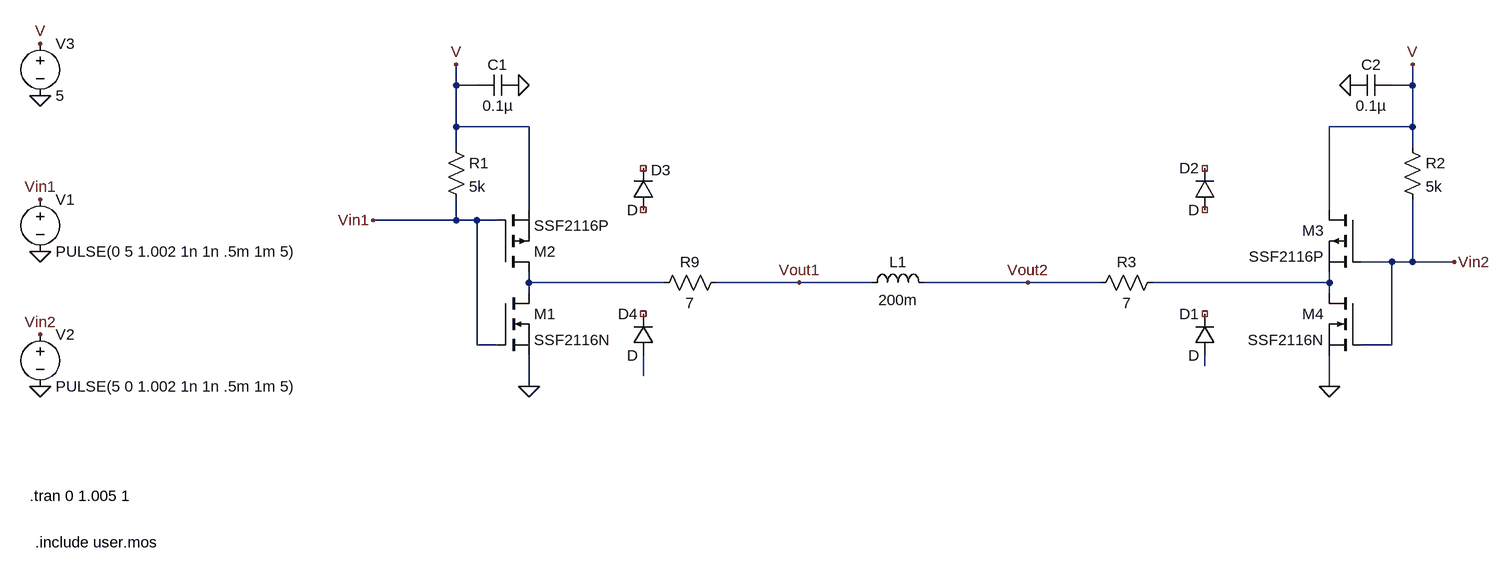
[diagram p0: schematic H-bridge.asc]
H-bridge.asc, the LTspice schematic file:
Version 4
SHEET 1 1344 852
WIRE -544 -256 -544 -288
WIRE -512 -256 -544 -256
WIRE 928 -256 928 -288
WIRE 928 -256 896 -256
WIRE -544 -192 -544 -256
WIRE -432 -192 -544 -192
WIRE 928 -192 928 -256
WIRE 928 -192 800 -192
WIRE -544 -160 -544 -192
WIRE 928 -160 928 -192
WIRE -432 -64 -432 -192
WIRE 800 -64 800 -192
WIRE -544 -48 -544 -80
WIRE -544 -48 -672 -48
WIRE -512 -48 -544 -48
WIRE -480 -48 -512 -48
WIRE 896 16 848 16
WIRE 928 16 928 -80
WIRE 928 16 896 16
WIRE 992 16 928 16
WIRE -432 48 -432 32
WIRE -224 48 -432 48
WIRE -16 48 -144 48
WIRE 96 48 -16 48
WIRE 336 48 176 48
WIRE 448 48 336 48
WIRE 800 48 800 32
WIRE 800 48 528 48
WIRE -432 64 -432 48
WIRE 800 64 800 48
WIRE -512 144 -512 -48
WIRE -480 144 -512 144
WIRE 896 144 896 16
WIRE 896 144 848 144
WIRE 608 176 608 160
WIRE -256 192 -256 160
WIRE -432 208 -432 160
WIRE 800 208 800 160
FLAG -432 208 0
FLAG -448 -256 0
FLAG -672 -48 Vin1
FLAG 800 208 0
FLAG 832 -256 0
FLAG -16 48 Vout1
FLAG 336 48 Vout2
FLAG 992 16 Vin2
FLAG -1184 -240 0
FLAG -1184 -320 V
FLAG -544 -288 V
FLAG 928 -288 V
FLAG -1184 208 0
FLAG -1184 0 0
FLAG -1184 -80 Vin1
FLAG -1184 128 Vin2
SYMBOL nmos -480 64 R0
SYMATTR InstName M1
SYMATTR Value SSF2116N
SYMBOL pmos -480 32 M180
SYMATTR InstName M2
SYMATTR Value SSF2116P
SYMBOL res -128 32 R90
WINDOW 0 0 56 VBottom 2
WINDOW 3 32 56 VTop 2
SYMATTR InstName R9
SYMATTR Value 7
SYMBOL voltage -1184 -96 R0
WINDOW 123 0 0 Left 0
WINDOW 39 0 0 Left 0
SYMATTR InstName V1
SYMATTR Value PULSE(0 5 1.002 1n 1n .5m 1m 5)
SYMBOL res -560 -176 R0
SYMATTR InstName R1
SYMATTR Value 5k
SYMBOL cap -448 -272 R90
WINDOW 0 0 32 VBottom 2
WINDOW 3 32 32 VTop 2
SYMATTR InstName C1
SYMATTR Value 0.1µ
SYMBOL ind 80 64 R270
WINDOW 0 32 56 VTop 2
WINDOW 3 5 56 VBottom 2
SYMATTR InstName L1
SYMATTR Value 200m
SYMBOL pmos 848 -64 M0
SYMATTR InstName M3
SYMATTR Value SSF2116P
SYMBOL nmos 848 64 M0
SYMATTR InstName M4
SYMATTR Value SSF2116N
SYMBOL res 912 -176 R0
SYMATTR InstName R2
SYMATTR Value 5k
SYMBOL cap 896 -272 R90
WINDOW 0 0 32 VBottom 2
WINDOW 3 32 32 VTop 2
SYMATTR InstName C2
SYMATTR Value 0.1µ
SYMBOL voltage -1184 112 R0
WINDOW 123 0 0 Left 0
WINDOW 39 0 0 Left 0
SYMATTR InstName V2
SYMATTR Value PULSE(5 0 1.002 1n 1n .5m 1m 5)
SYMBOL voltage -1184 -336 R0
WINDOW 123 0 0 Left 0
WINDOW 39 0 0 Left 0
SYMATTR InstName V3
SYMATTR Value 5
SYMBOL res 544 32 R90
WINDOW 0 0 56 VBottom 2
WINDOW 3 32 56 VTop 2
SYMATTR InstName R3
SYMATTR Value 7
SYMBOL diode 624 160 R180
WINDOW 0 24 64 Left 2
WINDOW 3 24 0 Left 2
SYMATTR InstName D1
SYMBOL diode 624 -64 R180
WINDOW 0 24 64 Left 2
WINDOW 3 24 0 Left 2
SYMATTR InstName D2
SYMBOL diode -240 -64 R180
WINDOW 0 -27 61 Left 2
WINDOW 3 24 0 Left 2
SYMATTR InstName D3
SYMBOL diode -240 160 R180
WINDOW 0 24 64 Left 2
WINDOW 3 24 0 Left 2
SYMATTR InstName D4
TEXT -1200 376 Left 2 !.tran 0 1.005 1
TEXT -1192 448 Left 2 !.include user.mos

The netlist it stands for:
* H-bridge.asc
M1 N001 Vin1 0 0 SSF2116N
M2 N001 Vin1 V V SSF2116P
R9 Vout1 N001 7
V1 Vin1 0 PULSE(0 5 1.002 1n 1n .5m 1m 5)
R1 V Vin1 5k
C1 0 V 0.1µ
L1 Vout1 Vout2 200m
M3 V Vin2 N002 N002 SSF2116P
M4 N002 Vin2 0 0 SSF2116N
R2 V Vin2 5k
C2 V 0 0.1µ
V2 Vin2 0 PULSE(5 0 1.002 1n 1n .5m 1m 5)
V3 V 0 5
R3 N002 Vout2 7
D1 N003 NC_01 D
D2 NC_02 NC_03 D
D3 NC_04 NC_05 D
D4 N004 NC_06 D
.model D D
.lib standard.dio
.model NMOS NMOS
.model PMOS PMOS
.lib standard.mos
.tran 0 1.005 1
.include user.mos
.backanno
.end